# Altium schematic sheet MicConnectros.SchDoc
size A4 portrait
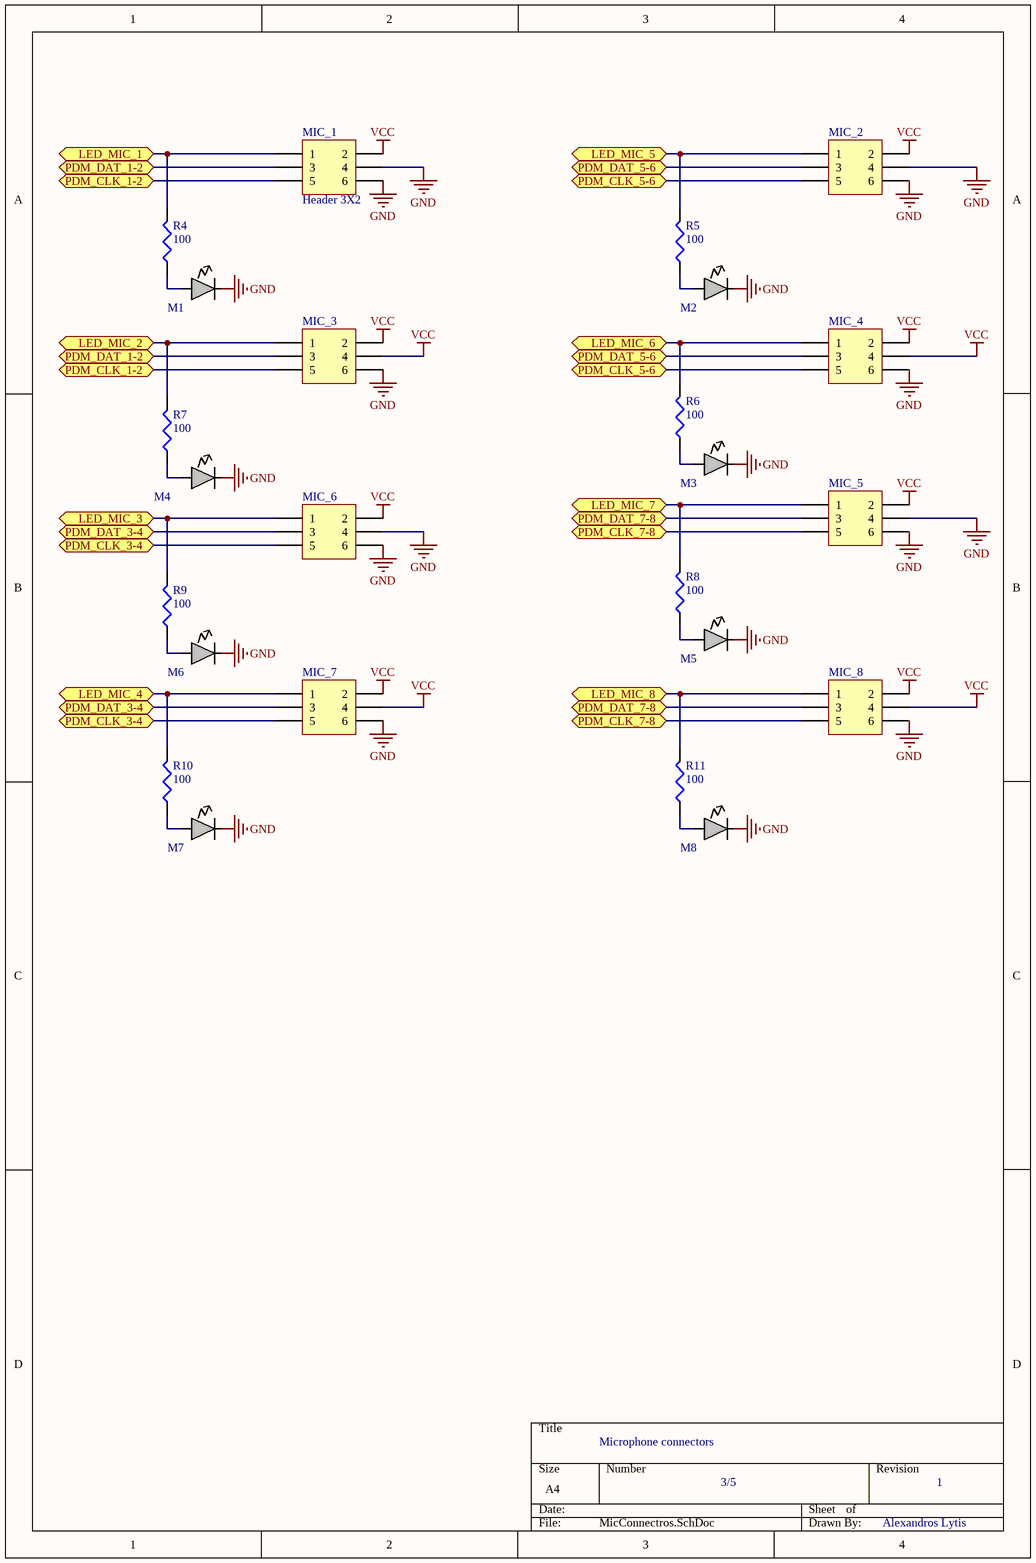
[diagram p0: MicConnectros.SchDoc]

## Parts
M1  LED_1.6x0.8mm  [J1-0603]  (value not drawn)
M2  LED_1.6x0.8mm  [J1-0603]  (value not drawn)
M3  LED_1.6x0.8mm  [J1-0603]  (value not drawn)
M4  LED_1.6x0.8mm  [J1-0603]  (value not drawn)
M5  LED_1.6x0.8mm  [J1-0603]  (value not drawn)
M6  LED_1.6x0.8mm  [J1-0603]  (value not drawn)
M7  LED_1.6x0.8mm  [J1-0603]  (value not drawn)
M8  LED_1.6x0.8mm  [J1-0603]  (value not drawn)
MIC_1  Header 3X2  [HDR2X3]
MIC_2  Header 3X2  [HDR2X3]  (value not drawn)
MIC_3  Header 3X2  [HDR2X3]  (value not drawn)
MIC_4  Header 3X2  [HDR2X3]  (value not drawn)
MIC_5  Header 3X2  [HDR2X3]  (value not drawn)
MIC_6  Header 3X2  [HDR2X3]  (value not drawn)
MIC_7  Header 3X2  [HDR2X3]  (value not drawn)
MIC_8  Header 3X2  [HDR2X3]  (value not drawn)
R4  value 100  [RES0603]  (hidden comment: Res3)
R5  value 100  [RES0603]  (hidden comment: Res3)
R6  value 100  [RES0603]  (hidden comment: Res3)
R7  value 100  [RES0603]  (hidden comment: Res3)
R8  value 100  [RES0603]  (hidden comment: Res3)
R9  value 100  [RES0603]  (hidden comment: Res3)
R10  value 100  [RES0603]  (hidden comment: Res3)
R11  value 100  [RES0603]  (hidden comment: Res3)

## Ports
LED_MIC_1, LED_MIC_2, LED_MIC_3, LED_MIC_4, LED_MIC_5, LED_MIC_6, LED_MIC_7, LED_MIC_8, PDM_CLK_1-2, PDM_CLK_3-4, PDM_CLK_5-6, PDM_CLK_7-8, PDM_DAT_1-2, PDM_DAT_3-4, PDM_DAT_5-6, PDM_DAT_7-8

## Nets
GND: M1.2 M2.2 M3.2 M4.2 M5.2 M6.2 M7.2 M8.2 MIC_1.4 MIC_1.6 MIC_2.4 MIC_2.6 MIC_3.6 MIC_4.6 MIC_5.4 MIC_5.6 MIC_6.4 MIC_6.6 MIC_7.6 MIC_8.6
VCC: MIC_1.2 MIC_2.2 MIC_3.2 MIC_3.4 MIC_4.2 MIC_4.4 MIC_5.2 MIC_6.2 MIC_7.2 MIC_7.4 MIC_8.2 MIC_8.4
LED_MIC_1: MIC_1.1 R4.2 ; port LED_MIC_1
LED_MIC_2: MIC_3.1 R7.2 ; port LED_MIC_2
LED_MIC_3: MIC_6.1 R9.2 ; port LED_MIC_3
LED_MIC_4: MIC_7.1 R10.2 ; port LED_MIC_4
LED_MIC_5: MIC_2.1 R5.2 ; port LED_MIC_5
LED_MIC_6: MIC_4.1 R6.2 ; port LED_MIC_6
LED_MIC_7: MIC_5.1 R8.2 ; port LED_MIC_7
LED_MIC_8: MIC_8.1 R11.2 ; port LED_MIC_8
PDM_CLK_1-2: MIC_1.5 MIC_3.5 ; port PDM_CLK_1-2
PDM_CLK_3-4: MIC_6.5 MIC_7.5 ; port PDM_CLK_3-4
PDM_CLK_5-6: MIC_2.5 MIC_4.5 ; port PDM_CLK_5-6
PDM_CLK_7-8: MIC_5.5 MIC_8.5 ; port PDM_CLK_7-8
PDM_DAT_1-2: MIC_1.3 MIC_3.3 ; port PDM_DAT_1-2
PDM_DAT_3-4: MIC_6.3 MIC_7.3 ; port PDM_DAT_3-4
PDM_DAT_5-6: MIC_2.3 MIC_4.3 ; port PDM_DAT_5-6
PDM_DAT_7-8: MIC_5.3 MIC_8.3 ; port PDM_DAT_7-8
NetM1_1: M1.1 R4.1
NetM2_1: M2.1 R5.1
NetM3_1: M3.1 R6.1
NetM4_1: M4.1 R7.1
NetM5_1: M5.1 R8.1
NetM6_1: M6.1 R9.1
NetM7_1: M7.1 R10.1
NetM8_1: M8.1 R11.1

## Notes on the sheet
- Microphone connectors
- 3/5
- 1
- Alexandros Lytis

## Library data of the parts
MIC_1-MIC_8 = Header 3X2: Header, 3-Pin, Dual row; LatestRevisionDate: 17-Jul-2002; LatestRevisionNote: Re-released for DXP Platform.; Publisher: Altium Limited
R4-R11 = Res3: Resistor; Published: 8-Jun-2000; LatestRevisionDate: 29-May-2009; LatestRevisionNote: IPC-7351 Footprint Added.; PackageReference: J1-0603; Publisher: Altium Limited; PackageDescription: Chip Resistor